# Altium project eZ80F91-Z20X.PrjPcb
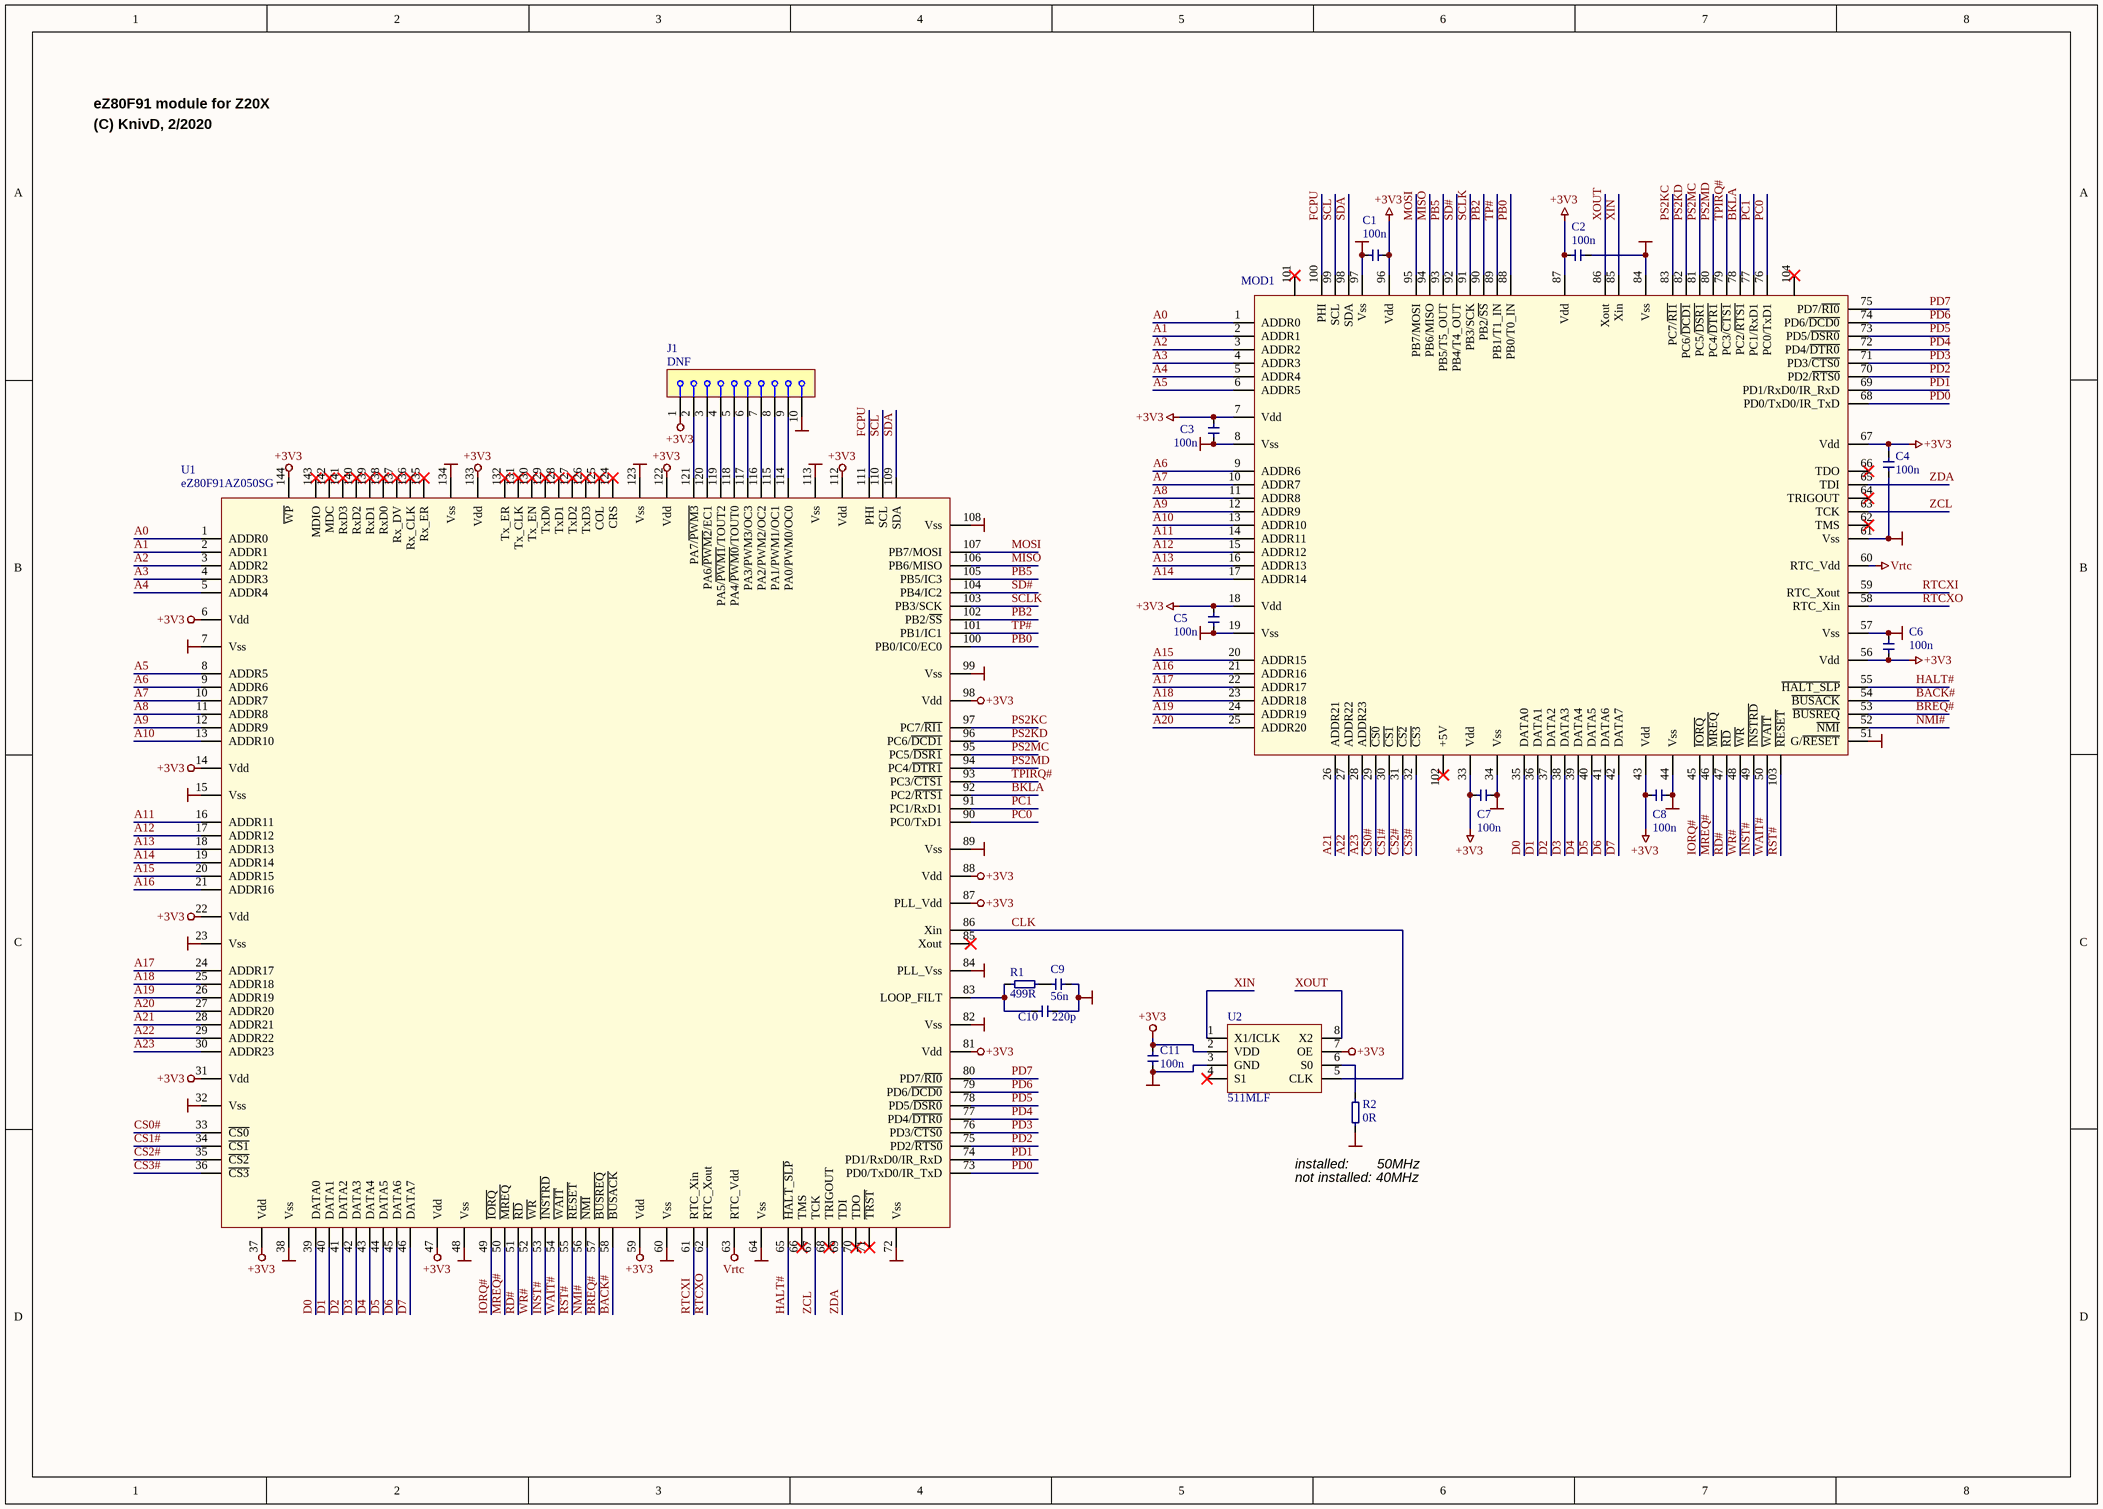
[diagram p0: main.SchDoc]
1 sheet, 17 parts. Net scope: global (net labels, ports and power ports of the same name join across sheets).
Board file: PCB.PcbDoc

## Sheet main.SchDoc: ELLO TROLL
size A3; Author: KnivD; DrawnBy: KnivD; Engineer: KnivD; DocumentNumber: 1; Revision: 1704; SheetNumber: 1; SheetTotal: 1; ProjectName: ELLO TROLL

### Parts
C1  100n  [_0805_CAP]
C2  100n  [_0805_CAP]
C3  100n  [_0805_CAP]
C4  100n  [_0805_CAP]
C5  100n  [_0805_CAP]
C6  100n  [_0805_CAP]
C7  100n  [_0805_CAP]
C8  100n  [_0805_CAP]
C9  56n  [_0805_CAP]
C10  220p  [_0805_CAP]
C11  100n  [_0805_CAP]
J1  DNF  [2011-1X10S]
MOD1  Z20X CPU Module  [PGA100X15]  (value not drawn)
R1  499R  [_0805_RES]
R2  0R  [_0805_RES]
U1  eZ80F91AZ050SG  [QFP50P2200X2200X160-144N]
U2  511MLF  [SOIC8]

### Nets
+3V3: C1.1 C2.2 C3.1 C4.2 C5.1 C6.1 C7.1 C8.1 C11.2 J1.1 MOD1.7(Vdd) MOD1.18(Vdd) MOD1.33(Vdd) MOD1.43(Vdd) MOD1.56(Vdd) MOD1.67(Vdd) MOD1.87(Vdd) MOD1.96(Vdd) U1.6(Vdd) U1.14(Vdd) U1.22(Vdd) U1.31(Vdd) U1.37(Vdd) U1.47(Vdd) U1.59(Vdd) U1.81(Vdd) U1.87(PLL_Vdd) U1.88(Vdd) U1.98(Vdd) U1.112(Vdd) U1.122(Vdd) U1.133(Vdd) U1.144(~{WP}) U2.2(VDD) U2.7(OE)
GND: C1.2 C2.1 C3.2 C4.1 C5.2 C6.2 C7.2 C8.2 C9.2 C10.2 C11.1 J1.10 MOD1.8(Vss) MOD1.19(Vss) MOD1.34(Vss) MOD1.44(Vss) MOD1.51(G/~{RESET}) MOD1.57(Vss) MOD1.61(Vss) MOD1.84(Vss) MOD1.97(Vss) R2.1 U1.7(Vss) U1.15(Vss) U1.23(Vss) U1.32(Vss) U1.38(Vss) U1.48(Vss) U1.60(Vss) U1.64(Vss) U1.72(Vss) U1.82(Vss) U1.84(PLL_Vss) U1.89(Vss) U1.99(Vss) U1.108(Vss) U1.113(Vss) U1.123(Vss) U1.134(Vss) U2.3(GND)
Vrtc: MOD1.60(RTC_Vdd) U1.63(RTC_Vdd)
A0: MOD1.1(ADDR0) U1.1(ADDR0)
A1: MOD1.2(ADDR1) U1.2(ADDR1)
A2: MOD1.3(ADDR2) U1.3(ADDR2)
A3: MOD1.4(ADDR3) U1.4(ADDR3)
A4: MOD1.5(ADDR4) U1.5(ADDR4)
A5: MOD1.6(ADDR5) U1.8(ADDR5)
A6: MOD1.9(ADDR6) U1.9(ADDR6)
A7: MOD1.10(ADDR7) U1.10(ADDR7)
A8: MOD1.11(ADDR8) U1.11(ADDR8)
A9: MOD1.12(ADDR9) U1.12(ADDR9)
A10: MOD1.13(ADDR10) U1.13(ADDR10)
A11: MOD1.14(ADDR11) U1.16(ADDR11)
A12: MOD1.15(ADDR12) U1.17(ADDR12)
A13: MOD1.16(ADDR13) U1.18(ADDR13)
A14: MOD1.17(ADDR14) U1.19(ADDR14)
A15: MOD1.20(ADDR15) U1.20(ADDR15)
A16: MOD1.21(ADDR16) U1.21(ADDR16)
A17: MOD1.22(ADDR17) U1.24(ADDR17)
A18: MOD1.23(ADDR18) U1.25(ADDR18)
A19: MOD1.24(ADDR19) U1.26(ADDR19)
A20: MOD1.25(ADDR20) U1.27(ADDR20)
A21: MOD1.26(ADDR21) U1.28(ADDR21)
A22: MOD1.27(ADDR22) U1.29(ADDR22)
A23: MOD1.28(ADDR23) U1.30(ADDR23)
BACK#: MOD1.54(~{BUSACK}) U1.58(~{BUSACK})
BKLA: MOD1.78(PC2/~{RTS1}) U1.92(PC2/~{RTS1})
BREQ#: MOD1.53(~{BUSREQ}) U1.57(~{BUSREQ})
CLK: U1.86(Xin) U2.5(CLK)
CS0#: MOD1.29(~{CS0}) U1.33(~{CS0})
CS1#: MOD1.30(~{CS1}) U1.34(~{CS1})
CS2#: MOD1.31(~{CS2}) U1.35(~{CS2})
CS3#: MOD1.32(~{CS3}) U1.36(~{CS3})
D0: MOD1.35(DATA0) U1.39(DATA0)
D1: MOD1.36(DATA1) U1.40(DATA1)
D2: MOD1.37(DATA2) U1.41(DATA2)
D3: MOD1.38(DATA3) U1.42(DATA3)
D4: MOD1.39(DATA4) U1.43(DATA4)
D5: MOD1.40(DATA5) U1.44(DATA5)
D6: MOD1.41(DATA6) U1.45(DATA6)
D7: MOD1.42(DATA7) U1.46(DATA7)
FCPU: MOD1.100(PHI) U1.111(PHI)
HALT#: MOD1.55(~{HALT_SLP}) U1.65(~{HALT_SLP})
INST#: MOD1.49(~{INSTRD}) U1.53(~{INSTRD})
IORQ#: MOD1.45(~{IORQ}) U1.49(~{IORQ})
MISO: MOD1.94(PB6/MISO) U1.106(PB6/MISO)
MOSI: MOD1.95(PB7/MOSI) U1.107(PB7/MOSI)
MREQ#: MOD1.46(~{MREQ}) U1.50(~{MREQ})
NMI#: MOD1.52(~{NMI}) U1.56(~{NMI})
PB0: MOD1.88(PB0/T0_IN) U1.100(PB0/IC0/EC0)
PB2: MOD1.90(PB2/~{SS}) U1.102(PB2/~{SS})
PB5: MOD1.93(PB5/T5_OUT) U1.105(PB5/IC3)
PC0: MOD1.76(PC0/TxD1) U1.90(PC0/TxD1)
PC1: MOD1.77(PC1/RxD1) U1.91(PC1/RxD1)
PD0: MOD1.68(PD0/TxD0/IR_TxD) U1.73(PD0/TxD0/IR_TxD)
PD1: MOD1.69(PD1/RxD0/IR_RxD) U1.74(PD1/RxD0/IR_RxD)
PD2: MOD1.70(PD2/~{RTS0}) U1.75(PD2/~{RTS0})
PD3: MOD1.71(PD3/~{CTS0}) U1.76(PD3/~{CTS0})
PD4: MOD1.72(PD4/~{DTR0}) U1.77(PD4/~{DTR0})
PD5: MOD1.73(PD5/~{DSR0}) U1.78(PD5/~{DSR0})
PD6: MOD1.74(PD6/~{DCD0}) U1.79(PD6/~{DCD0})
PD7: MOD1.75(PD7/~{RI0}) U1.80(PD7/~{RI0})
PS2KC: MOD1.83(PC7/~{RI1}) U1.97(PC7/~{RI1})
PS2KD: MOD1.82(PC6/~{DCD1}) U1.96(PC6/~{DCD1})
PS2MC: MOD1.81(PC5/~{DSR1}) U1.95(PC5/~{DSR1})
PS2MD: MOD1.80(PC4/~{DTR1}) U1.94(PC4/~{DTR1})
RD#: MOD1.47(~{RD}) U1.51(~{RD})
RST#: MOD1.103(~{RESET}) U1.55(~{RESET})
RTCXI: MOD1.59(RTC_Xout) U1.61(RTC_Xin)
RTCXO: MOD1.58(RTC_Xin) U1.62(RTC_Xout)
SCL: MOD1.99(SCL) U1.110(SCL)
SCLK: MOD1.91(PB3/SCK) U1.103(PB3/SCK)
SD#: MOD1.92(PB4/T4_OUT) U1.104(PB4/IC2)
SDA: MOD1.98(SDA) U1.109(SDA)
TP#: MOD1.89(PB1/T1_IN) U1.101(PB1/IC1)
TPIRQ#: MOD1.79(PC3/~{CTS1}) U1.93(PC3/~{CTS1})
WAIT#: MOD1.50(~{WAIT}) U1.54(~{WAIT})
WR#: MOD1.48(~{WR}) U1.52(~{WR})
XIN: MOD1.85(Xin) U2.1(X1/ICLK)
XOUT: MOD1.86(Xout) U2.8(X2)
ZCL: MOD1.63(TCK) U1.67(TCK)
ZDA: MOD1.65(TDI) U1.69(TDI)
NetC9_1: C9.1 R1.2
NetC10_1: C10.1 R1.1 U1.83(LOOP_FILT)
NetJ1_2: J1.2 U1.121(PA7/~{PWM3})
NetJ1_3: J1.3 U1.120(PA6/~{PWM2}/EC1)
NetJ1_4: J1.4 U1.119(PA5/~{PWM1}/TOUT2)
NetJ1_5: J1.5 U1.118(PA4/~{PWM0}/TOUT0)
NetJ1_6: J1.6 U1.117(PA3/PWM3/OC3)
NetJ1_7: J1.7 U1.116(PA2/PWM2/OC2)
NetJ1_8: J1.8 U1.115(PA1/PWM1/OC1)
NetJ1_9: J1.9 U1.114(PA0/PWM0/OC0)
NetR2_2: R2.2 U2.6(S0)

Not connected (* = marked no-connect by the designer): MOD1 62(TMS)* 64(TRIGOUT)* 66(TDO)* 101* 102(+5V)* 104*; U1 66(TMS)* 68(TRIGOUT)* 70(TDO)* 71(~{TRST})* 85(Xout)* 124(CRS)* 125(COL)* 126(TxD3)* 127(TxD2)* 128(TxD1)* 129(TxD0)* 130(Tx_EN)* 131(Tx_CLK)* 132(Tx_ER)* 135(Rx_ER)* 136(Rx_CLK)* 137(Rx_DV)* 138(RxD0)* 139(RxD1)* 140(RxD2)* 141(RxD3)* 142(MDC)* 143(MDIO)*; U2 4(S1)*

### Notes on the sheet
- eZ80F91 module for Z20X
- (C) KnivD, 2/2020
- (near R2) installed:       50MHz
- (near R2) not installed: 40MHz

### Library data of the parts
C1-C11 = Capacitor
J1 = Connector 1x10: Single row, 10-way connector
R1 R2 = Resistor
U1 = eZ80F91: eZ80Acclaim!® Flash Microcontrollers; Manufacturer: Zilog
U2 = ICS511: LOCO(tm) PLL CLOCK MULTIPLIER